# EAGLE design PCA9544A Breakout PCB (EAGLE 5.11)
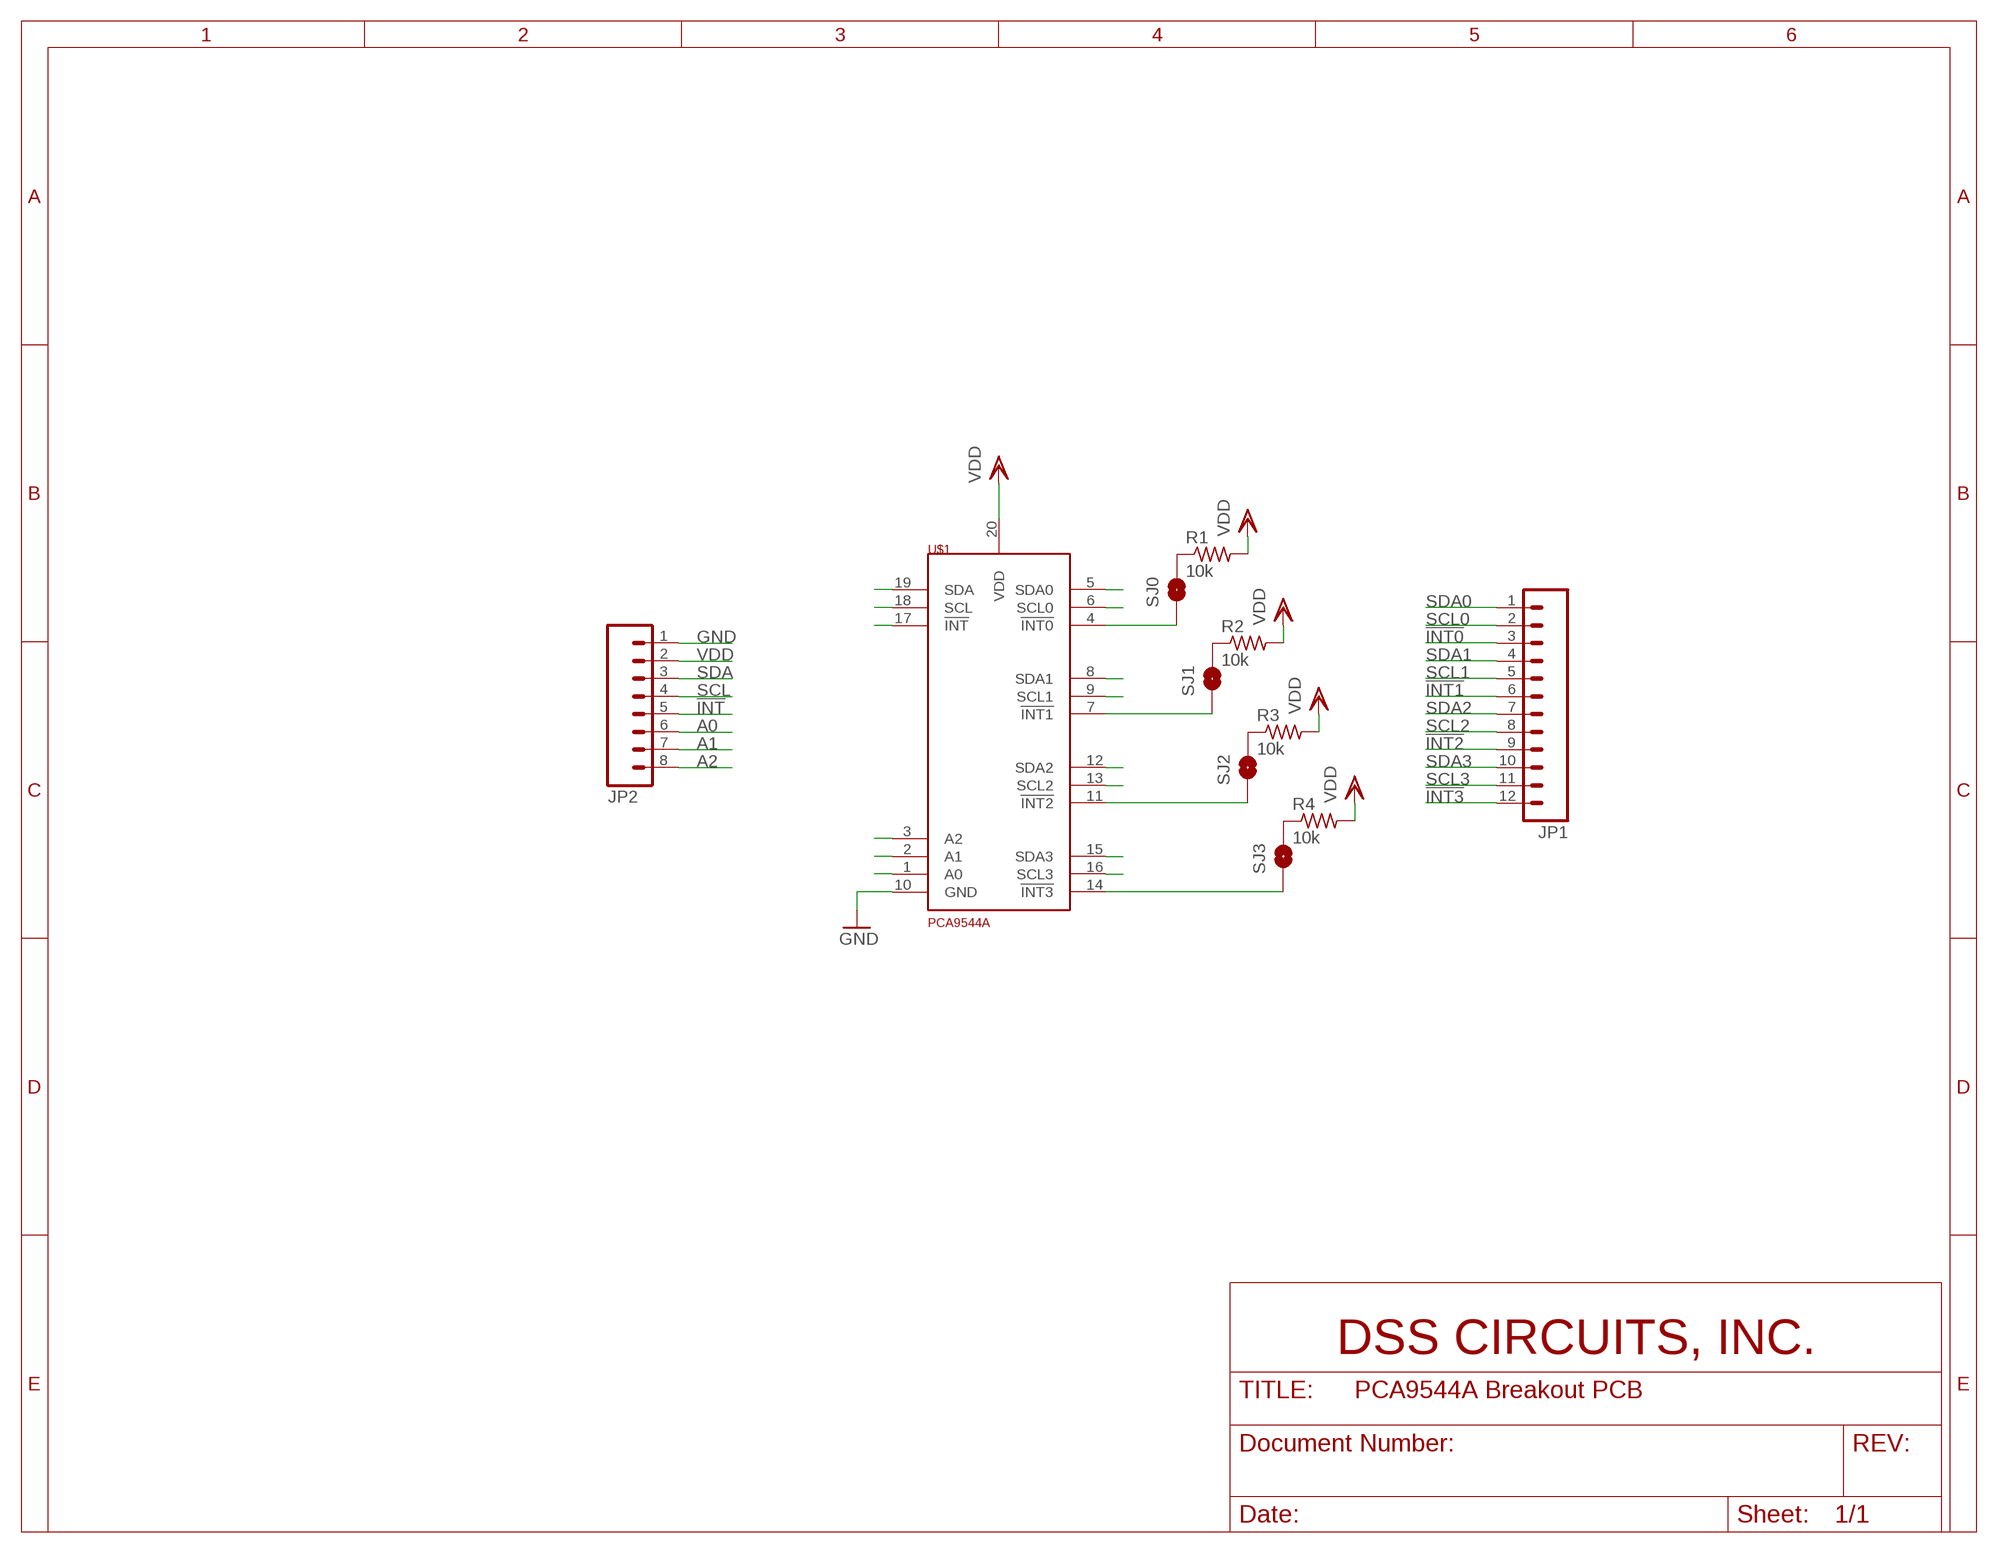
[diagram p0: schematic, sheet 1]

## Parts
JP1  M12PTH  [1X12]
JP2  M08  [1X08]
R1  10k  R-US_R0402  [R0402]
R2  10k  R-US_R0402  [R0402]
R3  10k  R-US_R0402  [R0402]
R4  10k  R-US_R0402  [R0402]
SJ0  SOLDERJUMPERTRACE  [SJ_2S-TRACE]
SJ1  SOLDERJUMPERTRACE  [SJ_2S-TRACE]
SJ2  SOLDERJUMPERTRACE  [SJ_2S-TRACE]
SJ3  SOLDERJUMPERTRACE  [SJ_2S-TRACE]
U$1  PCA9544A  [TSSOP20]

## Nets
!INT: JP2.5 U$1.17(!INT)
!INT0: JP1.3 SJ0.1 U$1.4(!INT0)
!INT1: JP1.6 SJ1.1 U$1.7(!INT1)
!INT2: JP1.9 SJ2.1 U$1.11(!INT2)
!INT3: JP1.12 SJ3.1 U$1.14(!INT3)
A0: JP2.6 U$1.1(A0)
A1: JP2.7 U$1.2(A1)
A2: JP2.8 U$1.3(A2)
GND: JP2.1 U$1.10(GND)
N$1: R1.1 SJ0.2
N$2: R2.1 SJ1.2
N$3: R3.1 SJ2.2
N$4: R4.1 SJ3.2
SCL: JP2.4 U$1.18(SCL)
SCL0: JP1.2 U$1.6(SCL0)
SCL1: JP1.5 U$1.9(SCL1)
SCL2: JP1.8 U$1.13(SCL2)
SCL3: JP1.11 U$1.16(SCL3)
SDA: JP2.3 U$1.19(SDA)
SDA0: JP1.1 U$1.5(SDA0)
SDA1: JP1.4 U$1.8(SDA1)
SDA2: JP1.7 U$1.12(SDA2)
SDA3: JP1.10 U$1.15(SDA3)
VDD: JP2.2 R1.2 R2.2 R3.2 R4.2 U$1.20(VDD)

## Library data of the parts
JP1 = SparkFun:M12: Header 12 Standard 12-pin 0.1" header. Use with straight break away headers (SKU : PRT-00116), right angle break away headers (PRT-00553), swiss pins (PRT-00743), machine pins (PRT-00117), and female headers (PRT-00115).
JP2 = SparkFun:M08: Header 8 Standard 8-pin 0.1" header. Use with straight break away headers (SKU : PRT-00116), right angle break away headers (PRT-00553), swiss pins (PRT-00743), machine pins (PRT-00117), and female headers (PRT-00115).
R1-R4 = resistor:R-US_: RESISTOR, American symbol
SJ0 SJ1-SJ3 = SparkFun:SOLDERJUMPER: Solder Jumper Standard SMD solder jumper. Used to automate production. Two varients : Normally Open and Normally Closed are the same, but have different paste layers. NC will have a large amount of paste and should jumper during reflow.
U$1 = DSSCircuits:PCA9544A

## Board
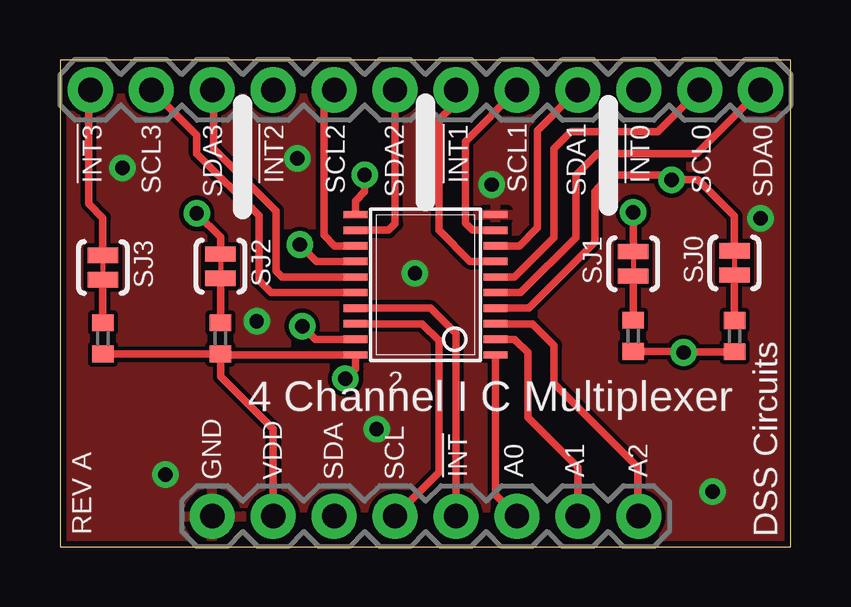
[diagram p1: board, top side]
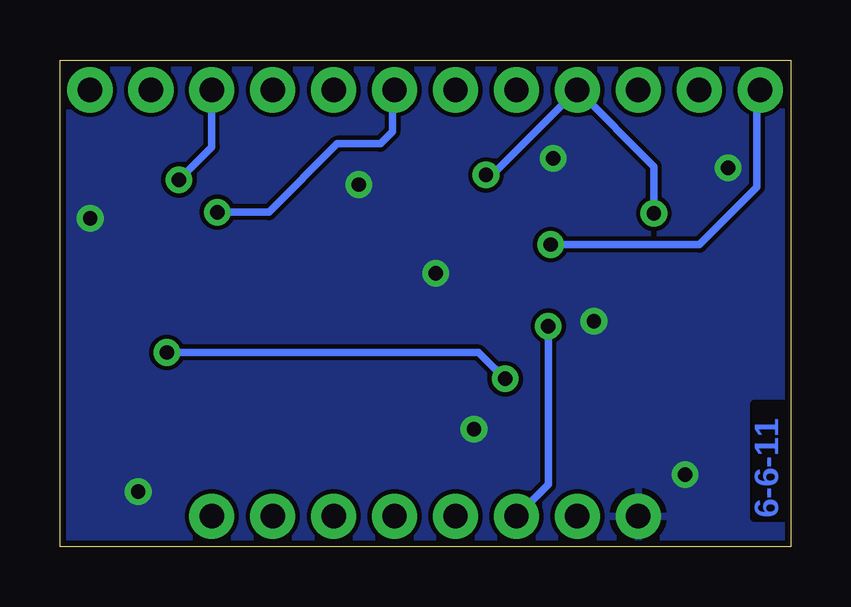
[diagram p2: board, bottom side, seen from below]

Size 30.46 x 20.3 mm. Coordinates in mm from the lower left corner, seen from the top.
Outline: 0,0 30.46,0 30.46,20.3 0,20.3 0,0
Copper layers (1*16): Top 0.035mm / dielectric 1.5mm / Bottom 0.035mm
Design rules "GoldPhoenix": minimum track width 7mil, minimum drill 15mil, track to track 7mil, track to pad 7mil, pad to pad 7mil, via to via 7mil, smd to smd 7mil, copper to edge 10mil, drill to drill 8mil, minimum pad ring 12mil, minimum via ring 10mil, stop-mask expansion 4mil, vias tented up to drill 25mil, thermal gap 10mil

### Footprints (pad centres in the part's own frame; a part is rotated, then mirrored left to right if it is on the bottom)
1X12 = drill 1.016 pad 1.88 round: 1 0,0; 2 2.54,0; 3 5.08,0; 4 7.62,0; 5 10.16,0; 6 12.7,0; 7 15.24,0; 8 17.78,0; 9 20.32,0; 10 22.86,0; 11 25.4,0; 12 27.94,0
1X08 = drill 1.016 pad 1.88 round: 1 0,0; 2 2.54,0; 3 5.08,0; 4 7.62,0; 5 10.16,0; 6 12.7,0; 7 15.24,0; 8 17.78,0
R0402 = smd 0.7 x 0.9: 1 -0.65,0; 2 0.65,0
SJ_2S-TRACE = smd 0.635 x 1.27: 1 -0.508,0; 2 0.508,0
TSSOP20 = smd 0.305 x 0.991: 1 -2.925,-2.918; 2 -2.275,-2.918; 3 -1.625,-2.918; 4 -0.975,-2.918; 5 -0.325,-2.918; 6 0.325,-2.918; 7 0.975,-2.918; 8 1.625,-2.918; 9 2.275,-2.918; 10 2.925,-2.918; 11 2.925,2.918; 12 2.275,2.918; 13 1.625,2.918; 14 0.975,2.918; 15 0.325,2.918; 16 -0.325,2.918; 17 -0.975,2.918; 18 -1.625,2.918; 19 -2.275,2.918; 20 -2.925,2.918

### Placement (x,y rotation side)
JP1  29.21,19.05 180 top
JP2  6.35,1.27 0 top
R1  28.12,8.78 270 top
R2  23.9,8.79 270 top
R3  6.69,8.69 270 top
R4  1.79,8.69 270 top
SJ0  28.12,11.83 270 top
SJ1  23.9,11.8 270 top
SJ2  6.69,11.7 270 top
SJ3  1.79,11.64 270 top
U$1  15.24,10.92 90 top

### Tracks (layer width: path | path; a pad name or v marks a point on that pad's centre or on a via)
!INT
  Top 0.305: JP2.5 16.51,8.89 15.45,9.95 U$1.17
!INT0  (via drill 0.6)
  Top 0.305: 28.15,12.37 SJ0.1 28.12,13.78 26.6,15.3 v25.5,15.3 25.4,15.5 22.9,15.5 22.3,14.8 22.3,12.7 19.55,9.95 U$1.4
  Bottom 0.305: JP1.3 24.13,16.67 v25.5,15.3
!INT1  (via drill 0.6)
  Top 0.305: U$1.7 17.1,11.9 15.8,13.2 15.8,17.8 16.5,18.5 JP1.6 | v23.9,13.95 SJ1.1
  Bottom 0.305: v23.9,13.95 21.75,13.95 18.9,16.8 17.1,16.8 16.6,17.3 16.6,18.96 JP1.6
!INT2  (via drill 0.6)
  Top 0.305: U$1.11 12.32,14.42 12.7,14.8 v12.7,15.5 | SJ2.1 6.69,12.91 v5.7,13.9
  Bottom 0.305: v12.7,15.5 12.44,15.5 JP1.9 5.7,15.86 v5.7,13.9
!INT3  (via drill 0.6)
  Top 0.305: U$1.14 10.7,11.9 v10,12.6 | SJ3.1 1.79,13.71 1.2,14.3 1.2,18.3 1.4,18.5 1.4,18.92 JP1.12
  Bottom 0.305: v10,12.6 3.8,12.6 1.4,15 1.4,18.92 JP1.12
A0
  Top 0.305: U$1.1 18.16,2.16 JP2.6
A1
  Top 0.305: U$1.2 18.95,8.65 19.5,8.1 19.5,5.4 21.6,3.3 JP2.7
A2
  Top 0.305: U$1.3 19.7,9.3 20.6,8.4 20.6,6.8 24.1,3.3 24.1,1.3 JP2.8
GND  (via drill 0.6)
  other vias: 4.4,3 18,15.1 27.2,2.3 9.9,16.2 29.2,13.7 14.8,11.4 13.2,4.9 8.2,9.4 2.6,15.8
  pour Top: 0.2,0.2 30.26,0.2 30.26,20.1 0.2,20.1
  pour Bottom: 0.15,0.15 30.31,0.15 30.31,20.15 0.15,20.15
N$1
  Top 0.305: R1.1 SJ0.2
N$2
  Top 0.305: R2.1 SJ1.2
N$3
  Top 0.305: R3.1 SJ2.2
N$4
  Top 0.305: R4.1 SJ3.2
SCL
  Top 0.305: U$1.18 15.1,9.3 15.8,8.6 15.8,3.1 JP2.4
SCL0
  Top 0.305: U$1.6 18.95,11.25 20.6,12.9 20.6,16.6 21.3,17.3 24.92,17.3 JP1.2
SCL1
  Top 0.305: U$1.9 17.2,13.2 16.9,13.5 16.9,16.9 JP1.5
SCL2
  Top 0.305: U$1.13 11.45,12.55 11,13 11,18.62 JP1.8
SCL3
  Top 0.305: U$1.16 8.8,10.6 8.3,11.1 8.3,13.8 5.7,16.4 5.7,17.16 JP1.11
SDA  (via drill 0.6)
  Top 0.305: U$1.19 10.65,8.65 v10.1,9.2
  Bottom 0.305: v10.1,9.2 10.1,2.6 JP2.3
SDA0
  Top 0.305: U$1.5 19.2,10.6 21.5,12.9 21.5,15.5 22.4,16.4 26.56,16.4 JP1.1
SDA1
  Top 0.305: U$1.8 19.15,12.55 19.9,13.3 19.9,17.36 JP1.4
SDA2
  Top 0.305: JP1.7 13.97,13.47 13.7,13.2 U$1.12
SDA3
  Top 0.305: U$1.15 9.25,11.25 9,11.5 9,14 6.4,16.6 6.4,19 JP1.10
VDD  (via drill 0.6)
  Top 0.305: R3.2 6.93,8 U$1.20 12.32,7.41 v11.91,7 v11.9,7 | JP2.2 8.89,4.91 6.7,7.1 R3.2 | R4.2 R3.2 | R2.2 25.96,8.14 v26,8.1 26.03,8.13 R1.2
  Top 0.406: R4.2
  Bottom 0.305: v26,8.1 13.01,8.1 12.32,7.41 12.31,7.41 v11.9,7

### Text on the board
Bottom: 6-6-11
tPlace: !INT3 | SCL3 | SDA3 | !INT2 | SCL2 | SDA2 | !INT1 | SCL1 | SDA1 | !INT0 | SCL0 | SDA0 | 2 | 4 Channel I C Multiplexer | GND | VDD | SDA | SCL | !INT | A0 | A1 | A2 | REV A | DSS Circuits